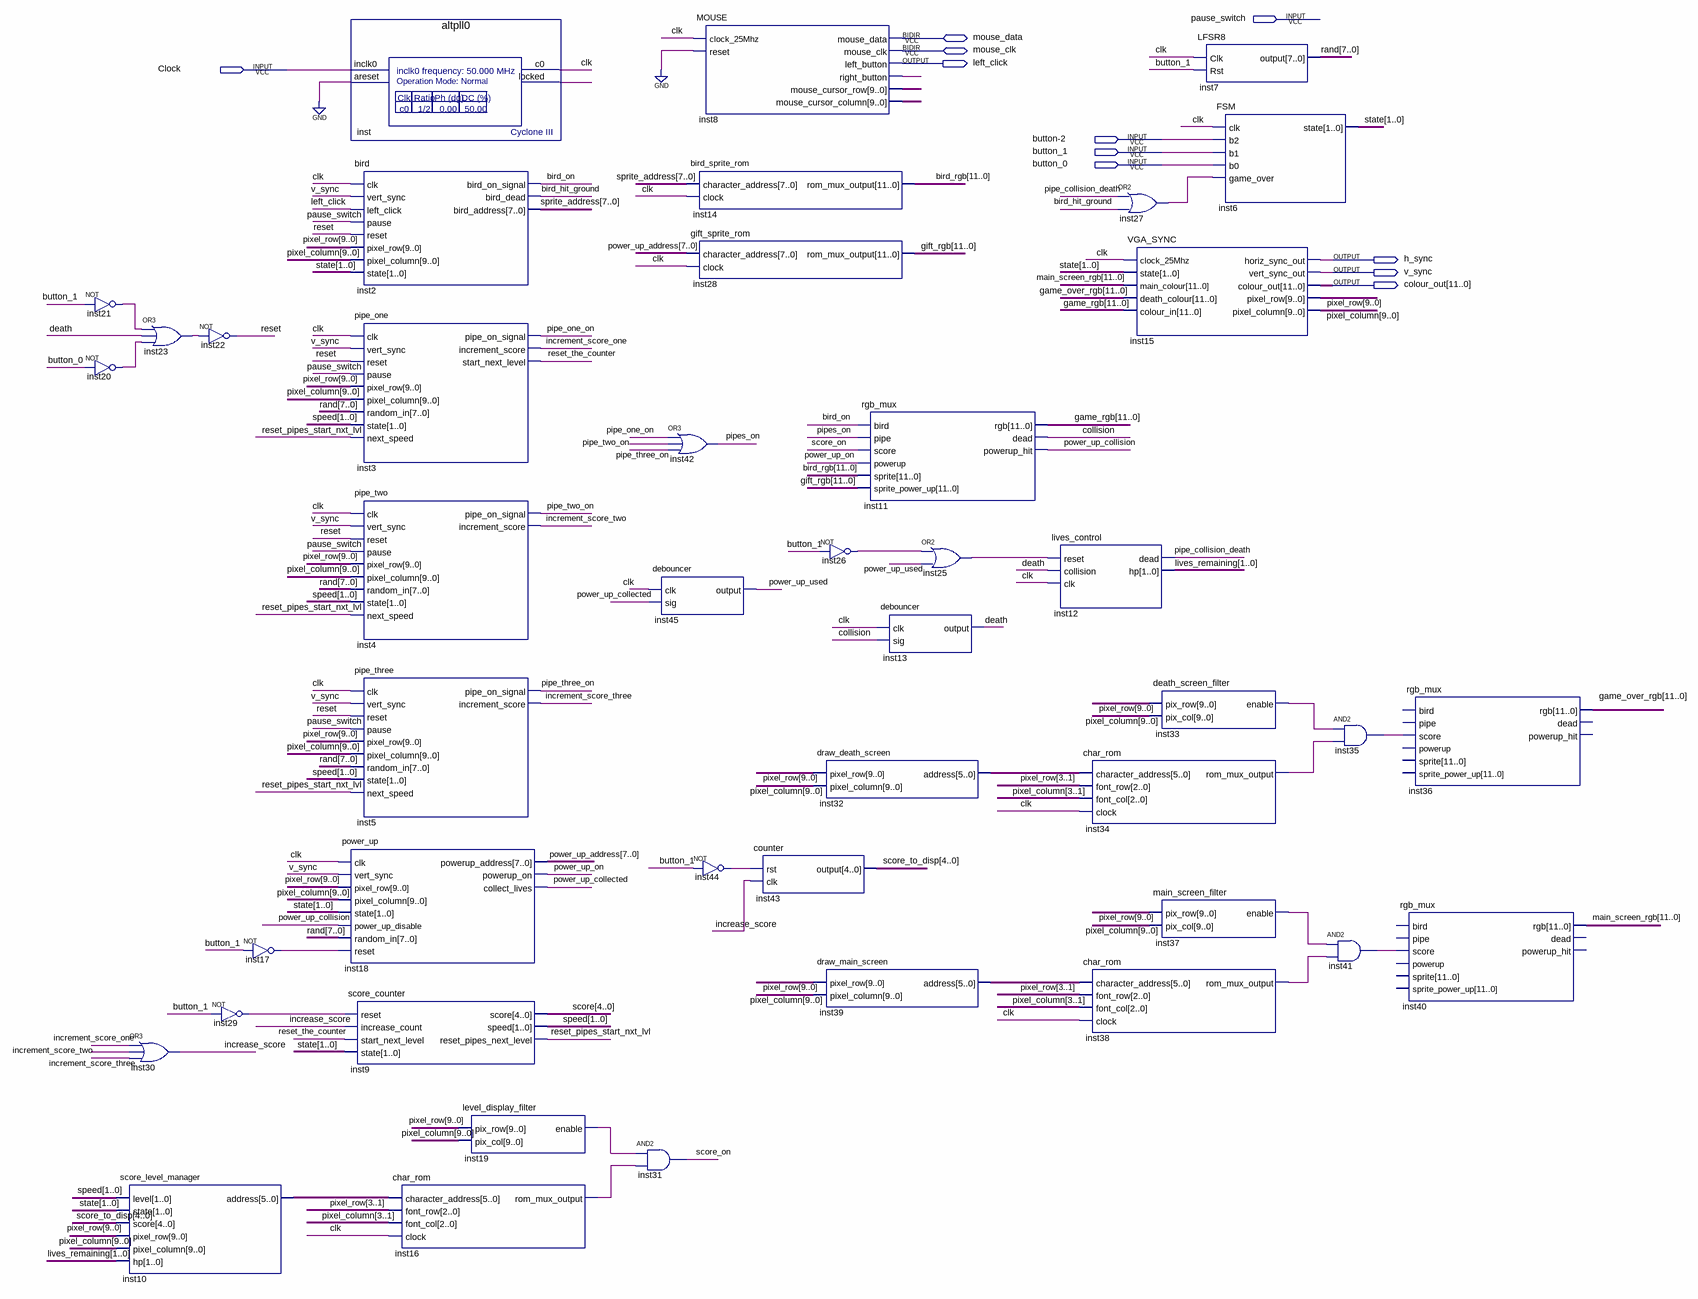
[diagram p0: schematic sheet]
// Quartus schematic FlappyBird.bdf as structural Verilog: 44 symbols, 11 pins
module FlappyBird (
  input  pause_switch,
  input  Clock,
  input  \button-2 ,
  input  button_1,
  input  button_0,
  inout  mouse_data,
  inout  mouse_clk,
  output left_click,
  output h_sync,
  output v_sync,
  output [11:0] colour_out
);

  wire bird_hit_ground, bird_on, clk, collision, death, increase_score, increment_score_one,
       increment_score_three, increment_score_two, inst8_right_button, inst16_rom_mux_output, inst17_out,
       inst19_enable, inst20_out, inst21_out, inst23_out, inst25_out, inst26_out, inst27_out, inst29_out,
       inst33_enable, inst34_rom_mux_output, inst35_out, inst37_enable, inst38_rom_mux_output, inst41_out,
       inst44_out, inst_locked, pipe_collision_death, pipe_one_on, pipe_three_on, pipe_two_on, pipes_on,
       power_up_collected, power_up_collision, power_up_on, power_up_used, reset, reset_pipes_start_nxt_lvl,
       reset_the_counter, score_on;
  wire [1:0] lives_remaining, speed, state;
  wire [4:0] score, score_to_disp;
  wire [5:0] inst10_address, inst32_address, inst39_address;
  wire [7:0] power_up_address, \rand , sprite_address;
  wire [9:0] inst8_mouse_cursor_column, inst8_mouse_cursor_row, pixel_column, pixel_row;
  wire [11:0] bird_rgb, game_over_rgb, game_rgb, gift_rgb, main_screen_rgb;

  not inst21 (inst21_out, button_1);
  not inst20 (inst20_out, button_0);
  or inst30 (increase_score, increment_score_one, increment_score_two, increment_score_three);
  score_level_manager inst10 (
    .level(speed), .state(state), .score(score_to_disp), .pixel_row(pixel_row), .pixel_column(pixel_column),
    .hp(lives_remaining), .address(inst10_address));
  or inst23 (inst23_out, inst21_out, death, inst20_out);
  not inst22 (reset, inst23_out);
  not inst29 (inst29_out, button_1);
  not inst17 (inst17_out, button_1);
  altpll0 inst (.inclk0(Clock), .areset(1'b0), .c0(clk), .locked(inst_locked));
  bird inst2 (
    .clk(clk), .vert_sync(v_sync), .left_click(left_click), .pause(pause_switch), .reset(reset),
    .pixel_row(pixel_row), .pixel_column(pixel_column), .state(state), .bird_on_signal(bird_on),
    .bird_dead(bird_hit_ground), .bird_address(sprite_address));
  pipe_one inst3 (
    .clk(clk), .vert_sync(v_sync), .reset(reset), .pause(pause_switch), .pixel_row(pixel_row),
    .pixel_column(pixel_column), .random_in(\rand ), .state(speed), .next_speed(reset_pipes_start_nxt_lvl),
    .pipe_on_signal(pipe_one_on), .increment_score(increment_score_one), .start_next_level(reset_the_counter));
  pipe_two inst4 (
    .clk(clk), .vert_sync(v_sync), .reset(reset), .pause(pause_switch), .pixel_row(pixel_row),
    .pixel_column(pixel_column), .random_in(\rand ), .state(speed), .next_speed(reset_pipes_start_nxt_lvl),
    .pipe_on_signal(pipe_two_on), .increment_score(increment_score_two));
  pipe_three inst5 (
    .clk(clk), .vert_sync(v_sync), .reset(reset), .pause(pause_switch), .pixel_row(pixel_row),
    .pixel_column(pixel_column), .random_in(\rand ), .state(speed), .next_speed(reset_pipes_start_nxt_lvl),
    .pipe_on_signal(pipe_three_on), .increment_score(increment_score_three));
  power_up inst18 (
    .clk(clk), .vert_sync(v_sync), .pixel_row(pixel_row), .pixel_column(pixel_column), .state(state),
    .power_up_disable(power_up_collision), .random_in(\rand ), .reset(inst17_out),
    .powerup_address(power_up_address), .powerup_on(power_up_on), .collect_lives(power_up_collected));
  score_counter inst9 (
    .reset(inst29_out), .increase_count(increase_score), .start_next_level(reset_the_counter), .state(state),
    .score(score), .speed(speed), .reset_pipes_next_level(reset_pipes_start_nxt_lvl));
  char_rom inst16 (
    .character_address(inst10_address), .font_row(pixel_row[3:1]), .font_col(pixel_column[3:1]), .clock(clk),
    .rom_mux_output(inst16_rom_mux_output));
  level_display_filter inst19 (.pix_row(pixel_row), .pix_col(pixel_column), .enable(inst19_enable));
  and inst31 (score_on, inst19_enable, inst16_rom_mux_output);
  bird_sprite_rom inst14 (.character_address(sprite_address), .clock(clk), .rom_mux_output(bird_rgb));
  gift_sprite_rom inst28 (.character_address(power_up_address), .clock(clk), .rom_mux_output(gift_rgb));
  or inst42 (pipes_on, pipe_one_on, pipe_two_on, pipe_three_on);
  debouncer inst45 (.clk(clk), .sig(power_up_collected), .\output (power_up_used));
  MOUSE inst8 (
    .clock_25Mhz(clk), .reset(1'b0), .left_button(left_click), .right_button(inst8_right_button),
    .mouse_cursor_row(inst8_mouse_cursor_row), .mouse_cursor_column(inst8_mouse_cursor_column),
    .mouse_data(mouse_data), .mouse_clk(mouse_clk));
  not inst44 (inst44_out, button_1);
  counter inst43 (.rst(inst44_out), .clk(increase_score), .\output (score_to_disp));
  not inst26 (inst26_out, button_1);
  draw_death_screen inst32 (.pixel_row(pixel_row), .pixel_column(pixel_column), .address(inst32_address));
  draw_main_screen inst39 (.pixel_row(pixel_row), .pixel_column(pixel_column), .address(inst39_address));
  rgb_mux inst11 (
    .bird(bird_on), .pipe(pipes_on), .score(score_on), .powerup(power_up_on), .sprite(bird_rgb),
    .sprite_power_up(gift_rgb), .rgb(game_rgb), .dead(collision), .powerup_hit(power_up_collision));
  debouncer inst13 (.clk(clk), .sig(collision), .\output (death));
  or inst25 (inst25_out, inst26_out, power_up_used);
  lives_control inst12 (
    .reset(inst25_out), .collision(death), .clk(clk), .dead(pipe_collision_death), .hp(lives_remaining));
  char_rom inst34 (
    .character_address(inst32_address), .font_row(pixel_row[3:1]), .font_col(pixel_column[3:1]), .clock(clk),
    .rom_mux_output(inst34_rom_mux_output));
  char_rom inst38 (
    .character_address(inst39_address), .font_row(pixel_row[3:1]), .font_col(pixel_column[3:1]), .clock(clk),
    .rom_mux_output(inst38_rom_mux_output));
  or inst27 (inst27_out, pipe_collision_death, bird_hit_ground);
  VGA_SYNC inst15 (
    .clock_25Mhz(clk), .state(state), .main_colour(main_screen_rgb), .death_colour(game_over_rgb),
    .colour_in(game_rgb), .horiz_sync_out(h_sync), .vert_sync_out(v_sync), .colour_out(colour_out),
    .pixel_row(pixel_row), .pixel_column(pixel_column));
  LFSR8 inst7 (.Clk(clk), .Rst(button_1), .\output (\rand ));
  death_screen_filter inst33 (.pix_row(pixel_row), .pix_col(pixel_column), .enable(inst33_enable));
  main_screen_filter inst37 (.pix_row(pixel_row), .pix_col(pixel_column), .enable(inst37_enable));
  FSM inst6 (.clk(clk), .b2(\button-2 ), .b1(button_1), .b0(button_0), .game_over(inst27_out), .state(state));
  and inst35 (inst35_out, inst33_enable, inst34_rom_mux_output);
  and inst41 (inst41_out, inst37_enable, inst38_rom_mux_output);
  rgb_mux inst40 (
    .score(inst41_out), .rgb(main_screen_rgb));  // open: bird, pipe, powerup, sprite, sprite_power_up, dead, powerup_hit
  rgb_mux inst36 (
    .score(inst35_out), .rgb(game_over_rgb));  // open: bird, pipe, powerup, sprite, sprite_power_up, dead, powerup_hit
endmodule
